# EAGLE design nrf52withamp (EAGLE 8.7.0)
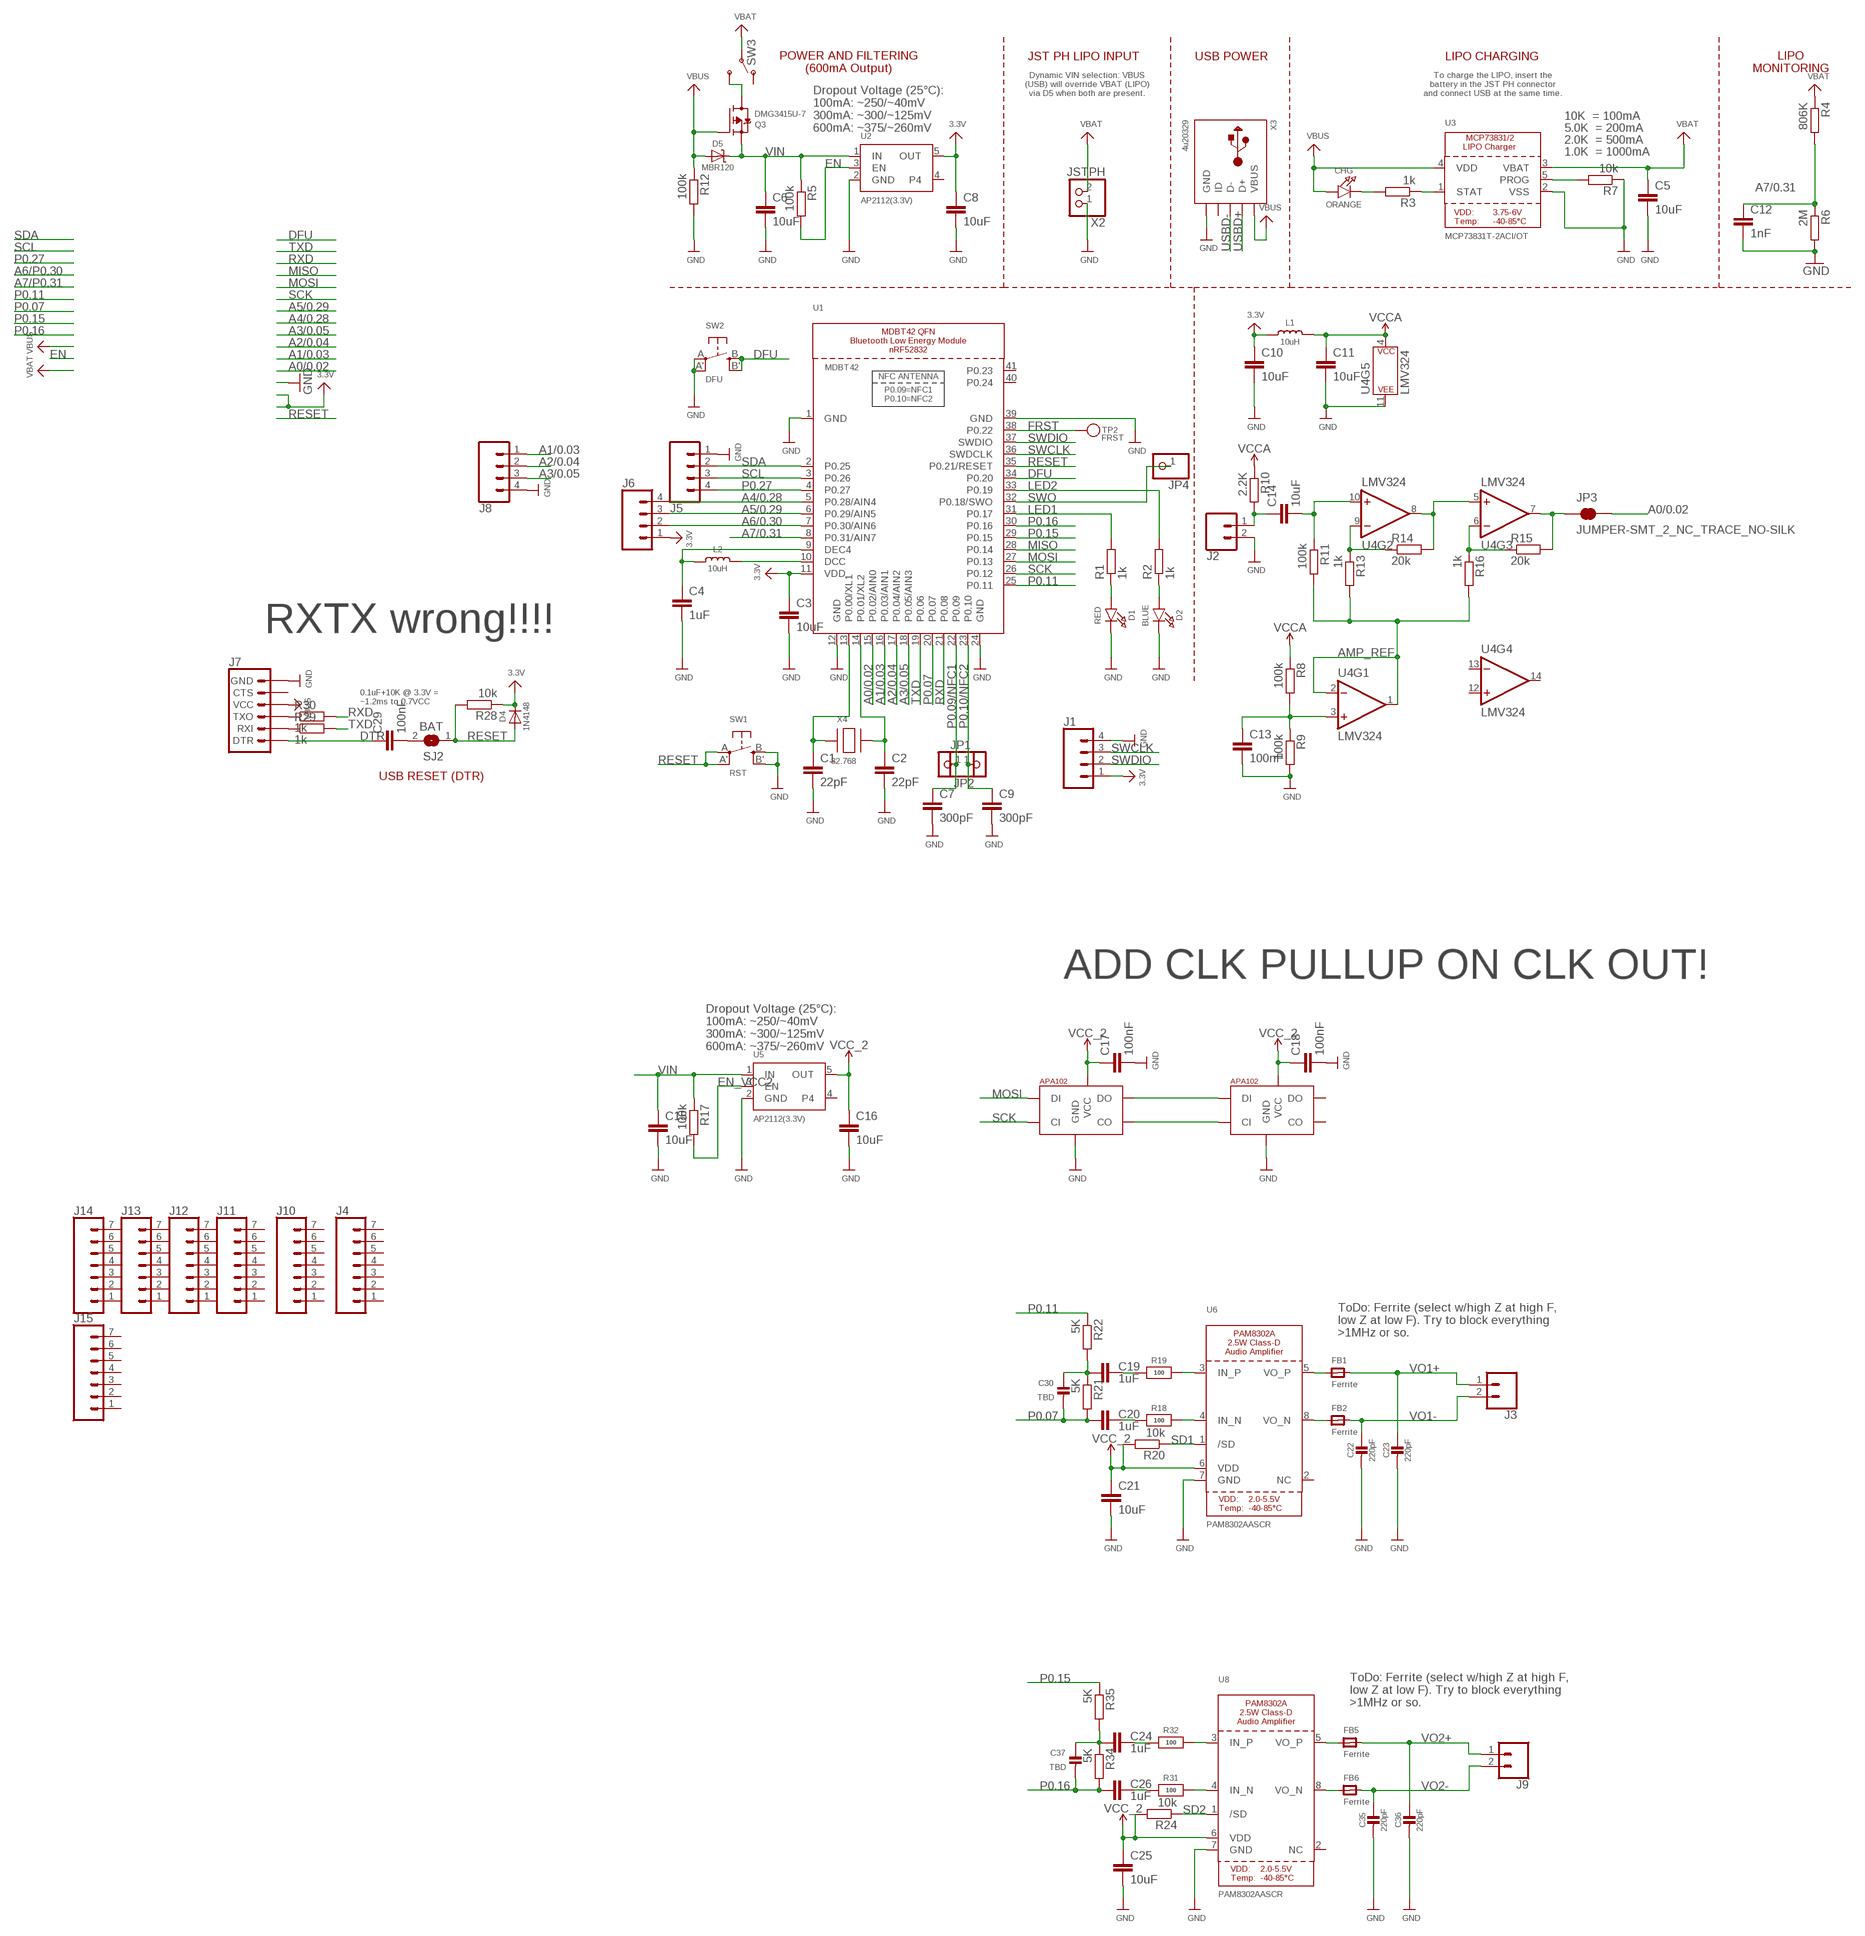
[diagram p0: schematic, sheet 1]

## Parts
C1  22pF  C-EUC0805  [C0805]
C2  22pF  C-EUC0805  [C0805]
C3  10uF  C-EUC0805  [C0805]
C4  1uF  C-EUC0805  [C0805]
C5  10uF  C-EUC0805  [C0805]
C6  10uF  C-EUC0805  [C0805]
C7  300pF  C-EUC0805  [C0805]
C8  10uF  C-EUC0805  [C0805]
C9  300pF  C-EUC0805  [C0805]
C10  10uF  C-EUC0805  [C0805]
C11  10uF  C-EUC0805  [C0805]
C12  1nF  C-EUC0805  [C0805]
C13  100nF  C-EUC0805  [C0805]
C14  10uF  C-EUC0805  [C0805]
C15  10uF  C-EUC0805  [C0805]
C16  10uF  C-EUC0805  [C0805]
C17  100nF  C-EUC0805  [C0805]
C18  100nF  C-EUC0805  [C0805]
C19  1uF  C-EUC0805  [C0805]
C20  1uF  C-EUC0805  [C0805]
C21  10uF  C-EUC0805  [C0805]
C22  220pF  CAP_CERAMIC0805-NOOUTLINE  [0805-NO]
C23  220pF  CAP_CERAMIC0805-NOOUTLINE  [0805-NO]
C24  1uF  C-EUC0805  [C0805]
C25  10uF  C-EUC0805  [C0805]
C26  1uF  C-EUC0805  [C0805]
C29  100nF  C-EUC0805  [C0805]
C30  TBD  CAP_CERAMIC0805-NOOUTLINE  [0805-NO]
C35  220pF  CAP_CERAMIC0805-NOOUTLINE  [0805-NO]
C36  220pF  CAP_CERAMIC0805-NOOUTLINE  [0805-NO]
C37  TBD  CAP_CERAMIC0805-NOOUTLINE  [0805-NO]
CHG  ORANGE  LED0805_NOOUTLINE  [CHIPLED_0805_NOOUTLINE]
D1  RED  LED0805_NOOUTLINE  [CHIPLED_0805_NOOUTLINE]
D2  BLUE  LED0805_NOOUTLINE  [CHIPLED_0805_NOOUTLINE]
D4  1N4148  DIODESOD-323  [SOD-323]
D5  MBR120  DIODE-SCHOTTKYSOD-123  [SOD-123]
FB1  Ferrite  FERRITE_0805  [_0805]
FB2  Ferrite  FERRITE_0805  [_0805]
FB5  Ferrite  FERRITE_0805  [_0805]
FB6  Ferrite  FERRITE_0805  [_0805]
J1  CONN_04SMD  [1X04_SMD_RA_MALE]
J2  CONN_02  [1X02]
J3  CONN_02  [1X02]
J4  CONN_07  [1X07]
J5  CONN_041.27MM  [1X04_1.27MM]
J6  CONN_041.27MM  [1X04_1.27MM]
J7  6_PIN_SERIAL_TARGETRA_SMT  [6_PIN_SERIAL_TARGET_SIDE_RA_SMT]
J8  CONN_041.27MM  [1X04_1.27MM]
J9  CONN_02  [1X02]
J10  CONN_07  [1X07]
J11  CONN_07  [1X07]
J12  CONN_07  [1X07]
J13  CONN_07  [1X07]
J14  CONN_07  [1X07]
J15  CONN_07  [1X07]
JP1  HEADER-1X12MM  [1X01_2MM]
JP2  HEADER-1X12MM  [1X01_2MM]
JP3  JUMPER-SMT_2_NC_TRACE_NO-SILK  [SMT-JUMPER_2_NC_TRACE_NO-SILK]
JP4  HEADER-1X12MM  [1X01_2MM]
L1  10uH  INDUCTOR0805-NO  [0805-NO@1]
L2  10uH  INDUCTOR0805-NO  [0805-NO@1]
Q3  DMG3415U-7  MOSFET-P  [SOT23-R]
R1  1k  R-EU_R0805  [R0805]
R2  1k  R-EU_R0805  [R0805]
R3  1k  R-EU_R0805  [R0805]
R4  806K  R-EU_R0805  [R0805]
R5  100k  R-EU_R0805  [R0805]
R6  2M  R-EU_R0805  [R0805]
R7  10k  R-EU_R0805  [R0805]
R8  100k  R-EU_R0805  [R0805]
R9  100k  R-EU_R0805  [R0805]
R10  2.2K  R-EU_R0805  [R0805]
R11  100k  R-EU_R0805  [R0805]
R12  100k  R-EU_R0805  [R0805]
R13  1k  R-EU_R0805  [R0805]
R14  20k  R-EU_R0805  [R0805]
R15  20k  R-EU_R0805  [R0805]
R16  1k  R-EU_R0805  [R0805]
R17  100k  R-EU_R0805  [R0805]
R18  100  RESISTOR0805_NOOUTLINE  [0805-NO]
R19  100  RESISTOR0805_NOOUTLINE  [0805-NO]
R20  10k  R-EU_R0805  [R0805]
R21  5K  R-EU_R0805  [R0805]
R22  5K  R-EU_R0805  [R0805]
R24  10k  R-EU_R0805  [R0805]
R28  10k  R-EU_R0805  [R0805]
R29  1k  R-EU_R0805  [R0805]
R30  1k  R-EU_R0805  [R0805]
R31  100  RESISTOR0805_NOOUTLINE  [0805-NO]
R32  100  RESISTOR0805_NOOUTLINE  [0805-NO]
R34  5K  R-EU_R0805  [R0805]
R35  5K  R-EU_R0805  [R0805]
SJ2  BAT  SOLDERJUMPERCLOSED  [SOLDERJUMPER_CLOSEDWIRE]
SW1  RST  SWITCH_TACT_SMT4.6X2.8  [BTN_KMR2_4.6X2.8]
SW2  DFU  SWITCH_TACT_SMT4.6X2.8  [BTN_KMR2_4.6X2.8]
SW3  SWITCH_SPDT  [KPS-1290]
TP2  FRST  TESTPOINT1.5X2.0MM_NOCREAM  [PAD-1.5X2.0]
U1  MDBT42  NRF52832_MODULE_MDBT42  [BLE_MODULE_RAYTAC_MDBT42]
U2  AP2112(3.3V)  VREG_SOT23-5  [SOT23-5]
U3  MCP73831T-2ACI/OT  MCP73831/2  [SOT23-5]
U4  LMV324  [SO14]
U5  AP2112(3.3V)  VREG_SOT23-5  [SOT23-5]
U6  PAM8302AASCR  AUDIOAMP_PAM8302A  [MSOP8_0.65MM]
U8  PAM8302AASCR  AUDIOAMP_PAM8302A  [MSOP8_0.65MM]
U$45  APA1022020  [APA102_2020]
U$51  APA1022020  [APA102_2020]
X2  JSTPH  CON_JST_PH_2PIN  [JSTPH2]
X3  4u20329  USB_MICRO_20329_V2  [4UCONN_20329_V2]
X4  32.768  XTAL-3.2X1.5  [XTAL3215]

## Nets
3.3V: C3.1 C8.1 C10.1 D4.C J1.1 J6.1 L1.1 R28.1 U1.11(VDD) U2.5(OUT)
A0/0.02: JP3.2 U1.15(P0.02/AIN0)
A1/0.03: J8.1 U1.16(P0.03/AIN1)
A2/0.04: J8.2 U1.17(P0.04/AIN2)
A3/0.05: J8.3 U1.18(P0.05/AIN3)
A4/0.28: J6.4 U1.5(P0.28/AIN4)
A5/0.29: J6.3 U1.6(P0.29/AIN5)
A6/0.30: J6.2 U1.7(P0.30/AIN6)
A7/0.31: C12.1 R4.2 R6.1 U1.8(P0.31/AIN7)
AMP_REF: R11.2 R13.2 R16.2 U4.1(OUT) U4.2(-IN)
CO1: U$45.CL_OUT(CO) U$51.C_IN(CI)
DFU: SW2.B'(S1) SW2.B(S) U1.34(P0.20)
DTR: C29.1 J7.1(DTR)
EN: R5.2 U2.3(EN)
EN_VCC2: R17.2 U5.3(EN)
FRST: TP2.P$1 U1.38(P0.22)
GND: C1.2 C2.2 C3.2 C4.2 C5.2 C6.2 C7.2 C8.2 C9.2 C10.2 C11.2 C12.2 C13.2 C15.2 C16.2 C17.2 C18.2 C21.2 C22.2 C23.2 C25.2 C35.2 C36.2 D1.C D2.C J1.4 J2.2 J5.1 J7.6(GND) J8.4 R6.2 R7.1 R9.2 R12.2 SW1.B'(S1) SW1.B(S) SW2.A'(P1) SW2.A(P) U1.1(GND) U1.12(GND) U1.24(GND) U1.39(GND) U2.2(GND) U3.2(VSS) U4.11(P$V-) U5.2(GND) U6.7(GND) U8.7(GND) U$45.GND U$51.GND X2.1 X3.BASE@1(GND) X3.BASE@2(GND) X3.GND X3.SPRT@1(GND) X3.SPRT@2(GND) X3.SPRT@3(GND) X3.SPRT@4(GND)
LED1: R1.2 U1.31(P0.17)
LED2: R2.2 U1.33(P0.19)
MISO: U1.28(P0.14)
MOSI: U1.27(P0.13) U$45.D_IN(DI)
N$1: C1.1 U1.13(P0.00/XL1) X4.P$1
N$2: C2.1 U1.14(P0.01/XL2) X4.P$2
N$3: L2.2 U1.10(DCC)
N$4: CHG.C R3.2
N$5: D1.A R1.1
N$6: C13.1 R8.2 R9.1 U4.3(+IN)
N$7: D2.A R2.1
N$8: C4.1 L2.1 U1.9(DEC4)
N$9: R3.1 U3.1(STAT)
N$10: R7.2 U3.5(PROG)
N$11: C14.1 J2.1 R10.2
N$12: C14.2 R11.1 U4.10(+IN)
N$13: C29.2 SJ2.2
N$14: U$45.D_OUT(DO) U$51.D_IN(DI)
N$15: R13.1 R14.1 U4.9(-IN)
N$16: R14.2 U4.5(+IN) U4.8(OUT)
N$17: R15.1 R16.1 U4.6(-IN)
N$18: JP3.1 R15.2 U4.7(OUT)
N$19: R18.2 U6.4(IN_N)
N$20: R19.2 U6.3(IN_P)
N$21: C20.2 R18.1
N$22: FB2.1 U6.8(VO_N)
N$23: FB1.1 U6.5(VO_P)
N$24: C19.2 R19.1
N$25: C19.1 C30.1 R21.1 R22.2
N$26: Q3.3(D) SW3.S
N$33: J7.3(RXI) R29.1
N$34: J7.2(TXO) R30.1
N$35: R31.2 U8.4(IN_N)
N$36: R32.2 U8.3(IN_P)
N$37: C26.2 R31.1
N$38: FB6.1 U8.8(VO_N)
N$39: FB5.1 U8.5(VO_P)
N$40: C24.2 R32.1
N$41: C24.1 C37.1 R34.1 R35.2
P0.07: C20.1 C30.2 R21.2 U1.20(P0.07)
P0.09/NFC1: C7.1 JP2.1 U1.22(P0.09)
P0.10/NFC2: C9.1 JP1.1 U1.23(P0.10)
P0.11: R22.1 U1.25(P0.11)
P0.15: R35.1 U1.29(P0.15)
P0.16: C26.1 C37.2 R34.2 U1.30(P0.16)
P0.27: J5.4 U1.4(P0.27)
RESET: D4.A R28.2 SJ2.1 SW1.A'(P1) SW1.A(P) U1.35(P0.21/RESET)
RXD: R30.2 U1.21(P0.08)
SCK: U1.26(P0.12) U$45.C_IN(CI)
SCL: J5.3 U1.3(P0.26)
SD1: R20.1 U6.1(/SD)
SD2: R24.1 U8.1(/SD)
SDA: J5.2 U1.2(P0.25)
SWCLK: J1.3 U1.36(SWDCLK)
SWDIO: J1.2 U1.37(SWDIO)
SWO: JP4.1 U1.32(P0.18/SWO)
TXD: R29.2 U1.19(P0.06)
USBD+: X3.D+
USBD-: X3.D-
VBAT: C5.1 R4.1 SW3.P U3.3(VBAT) X2.2
VBUS: CHG.A D5.A J7.4(VCC) Q3.1(G) R12.1 U3.4(VDD) X3.VBUS
VCC_2: C16.1 C17.1 C18.1 C21.1 C25.1 R20.2 R24.2 U5.5(OUT) U6.6(VDD) U8.6(VDD) U$45.V_CC(VCC) U$51.V_CC(VCC)
VCCA: C11.1 L1.2 R8.1 R10.1 U4.4(P$V+)
VIN: C6.1 C15.1 D5.C Q3.2(S) R5.1 R17.1 U2.1(IN) U5.1(IN)
VO1+: C23.1 FB1.2 J3.1
VO1-: C22.1 FB2.2 J3.2
VO2+: C36.1 FB5.2 J9.1
VO2-: C35.1 FB6.2 J9.2
Unconnected: J4.1 J4.2 J4.3 J4.4 J4.5 J4.6 J4.7 J7.5(CTS) J10.1 J10.2 J10.3 J10.4 J10.5 J10.6 J10.7 J11.1 J11.2 J11.3 J11.4 J11.5 J11.6 J11.7 J12.1 J12.2 J12.3 J12.4 J12.5 J12.6 J12.7 J13.1 J13.2 J13.3 J13.4 J13.5 J13.6 J13.7 J14.1 J14.2 J14.3 J14.4 J14.5 J14.6 J14.7 J15.1 J15.2 J15.3 J15.4 J15.5 J15.6 J15.7 SW3.O U1.40(P0.24) U1.41(P0.23) U2.4 U4.12(+IN) U4.13(-IN) U4.14(OUT) U5.4 U6.2(NC) U8.2(NC) U$51.CL_OUT(CO) U$51.D_OUT(DO) X3.ID

## Notes on the sheet
- JST PH LIPO INPUT | USB POWER | LIPO CHARGING
- POWER AND FILTERING
  (600mA Output)
- LIPO
  MONITORING
- Dynamic VIN selection: VBUS
  (USB) will override VBAT (LIPO)
  via D5 when both are present.
- To charge the LIPO, insert the
  battery in the JST PH connector
  and connect USB at the same time.
- 10K  = 100mA
- Dropout Voltage (25°C):
  100mA: ~250/~40mV
  300mA: ~300/~125mV
  600mA: ~375/~260mV
- 5.0K  = 200mA
- 2.0K  = 500mA
- 1.0K  = 1000mA
- RXTX wrong!!!!
- 0.1uF+10K @ 3.3V =
  ~1.2ms to 0.7VCC
- USB RESET (DTR)
- ADD CLK PULLUP ON CLK OUT!
- Dropout Voltage (25°C):
  100mA: ~250/~40mV
  300mA: ~300/~125mV
  600mA: ~375/~260mV
- ToDo: Ferrite (select w/high Z at high F,
  low Z at low F). Try to block everything
  >1MHz or so.
- ToDo: Ferrite (select w/high Z at high F,
  low Z at low F). Try to block everything
  >1MHz or so.

## Library data of the parts
C1 C2 = rcl:C-EU: CAPACITOR, European symbol; LCSC: C1836; SPICEPREFIX: C
C3 C5 C6 C8 C10 C11 C14-C16 C21 C25 = rcl:C-EU: CAPACITOR, European symbol; LCSC: C1713; SPICEPREFIX: C
C4 C19 C20 C24 C26 = rcl:C-EU: CAPACITOR, European symbol; LCSC: C29822; SPICEPREFIX: C
C7 C9 = rcl:C-EU: CAPACITOR, European symbol; LCSC: C1735; SPICEPREFIX: C
C12 = rcl:C-EU: CAPACITOR, European symbol; LCSC: C16005; SPICEPREFIX: C
C13 C17 C18 C29 = rcl:C-EU: CAPACITOR, European symbol; LCSC: C28378; SPICEPREFIX: C
C22 C23 C35 C36 = microbuilder:CAP_CERAMIC: Ceramic Capacitors For new designs, use the packages preceded by an '_' character since they are more reliable: The following footprints should be used on most boards: _0402 - Standard footprint for regular board layouts _0603 - Standard footprint for regular board layouts _0805 - Standard footprint for regular board layouts _1206 - Standard footprint for regular board layouts For extremely tight-pitch boards where space is at a premium, the following 'micro-pitch' footprints can be used (smaller pads, no silkscreen outline, etc.): _0402MP - Micro-pitch footprint for very dense/compact boards _0603MP - Micro-pitch footprint for very dense/compact boards _0805MP - Micro-pitch footprint for very dense/compact boards _1206MP - Micro-pitch footprint for very dense/compact boards; LCSC: C46326
C30 C37 = microbuilder:CAP_CERAMIC: Ceramic Capacitors For new designs, use the packages preceded by an '_' character since they are more reliable: The following footprints should be used on most boards: _0402 - Standard footprint for regular board layouts _0603 - Standard footprint for regular board layouts _0805 - Standard footprint for regular board layouts _1206 - Standard footprint for regular board layouts For extremely tight-pitch boards where space is at a premium, the following 'micro-pitch' footprints can be used (smaller pads, no silkscreen outline, etc.): _0402MP - Micro-pitch footprint for very dense/compact boards _0603MP - Micro-pitch footprint for very dense/compact boards _0805MP - Micro-pitch footprint for very dense/compact boards _1206MP - Micro-pitch footprint for very dense/compact boards
CHG = microbuilder:LED: LED 0603 - 0603 Surface Mount Package 2mA: Green LED - Low Power (3.9mcd, 2ma, 1.7Vf) - Digikey: 475-2709-2-ND Orange LED - Low Power (9.8mcd, 2ma, 1.8Vf) - Digikey: 475-1194-2-ND Red LED - Low Power (5mcd, 2ma, 1.8Vf) - Digikey: 475-1195-2-ND Yellow LED - Low Power (7mcd, 2ma, 1.8Vf) - Digikey: 475-1196-2-ND 5mA: Blue LED - Low Power (17mcd, 5ma, 2.9Vf) - Digikey: LNJ937W8CRACT-ND 0805 - 0805 Surface Mount Package 2mA: Red LED (8.8mcd, 2mA, 1.8Vf, Clear) - Low Power [Digikey: 475-2510-1-ND] Green LED (5mcd, 2mA, 1.8Vf, Clear) - Low Power [Digikey: 475-2730-1-ND] Yellow LED (11.3mcd, 2mA, 1.8Vf, Clear) - Low Power [Digikey: 475-2555-1-ND] 20mA: Red LED (104mcd, 20mA, Diffused) - LS R976 [Digikey: 475-1278-6-ND] Red LED (12mcd, 20mA, 2.0Vf, Clear) - APT2012EC [Digikey: 754-1128-1-ND] Green LED (15mcd, 20mA, 2.2Vf, Clear) - APT2012GC [Digikey: 754-1131-1-ND] Orange LED (160mcd, 20mA, 2.1Vf, Clear) - APT2012SECK [Digikey: 754-1130-1-ND] 1206 - 1206 Surface Mount Package Green LED (26mcd, 20mA, Diffused) - LG N971 [Digikey: 475-1407-6-ND] Red LED (15mcd, 20mA, Diffused) - LH N974 [Digikey: 475-1416-6-ND] Cree - Cree High-Power Surface Mount LEDs XPEBWT-L1-0000-00D50 - White 111lm 350mA 2.9Vf 6200K 110° XTEAWT-00-0000-00000LEE3 - White 114lm 350mA 2.85Vf 5000K 115° Everlight - Everlight 45-21 Series Surface Mount LEDs 45-21/QK2C-B2832AC2CB2/2T - Warm White 2000mcd 20mA 3.25Vf 3050K 120° 45-21/LK2C-B38452C4CB2/2T - Nuetral White 2000mcd 20mA 3.25Vf 4150K 120° 45-21/LK2C-B50634C6CB2/2T - Cold White 2200mcd 20mA 3.25Vf 5650K 120° PLCC2 Reverse Mount LS T77K-J1L2-1-0-2-R18-Z - Red 11.25mcd 2mA 1.8Vf 630nm 120° LO T77K-L1M2-24-Z - Orange 19.6mcd 2mA 1.8Vf 606nm 120° LY T77K-K2M1-26-Z - Yellow 15.7mcd 2mA 1.8Vf 587nm 120°; LCSC: C154481
D1 = microbuilder:LED: LED 0603 - 0603 Surface Mount Package 2mA: Green LED - Low Power (3.9mcd, 2ma, 1.7Vf) - Digikey: 475-2709-2-ND Orange LED - Low Power (9.8mcd, 2ma, 1.8Vf) - Digikey: 475-1194-2-ND Red LED - Low Power (5mcd, 2ma, 1.8Vf) - Digikey: 475-1195-2-ND Yellow LED - Low Power (7mcd, 2ma, 1.8Vf) - Digikey: 475-1196-2-ND 5mA: Blue LED - Low Power (17mcd, 5ma, 2.9Vf) - Digikey: LNJ937W8CRACT-ND 0805 - 0805 Surface Mount Package 2mA: Red LED (8.8mcd, 2mA, 1.8Vf, Clear) - Low Power [Digikey: 475-2510-1-ND] Green LED (5mcd, 2mA, 1.8Vf, Clear) - Low Power [Digikey: 475-2730-1-ND] Yellow LED (11.3mcd, 2mA, 1.8Vf, Clear) - Low Power [Digikey: 475-2555-1-ND] 20mA: Red LED (104mcd, 20mA, Diffused) - LS R976 [Digikey: 475-1278-6-ND] Red LED (12mcd, 20mA, 2.0Vf, Clear) - APT2012EC [Digikey: 754-1128-1-ND] Green LED (15mcd, 20mA, 2.2Vf, Clear) - APT2012GC [Digikey: 754-1131-1-ND] Orange LED (160mcd, 20mA, 2.1Vf, Clear) - APT2012SECK [Digikey: 754-1130-1-ND] 1206 - 1206 Surface Mount Package Green LED (26mcd, 20mA, Diffused) - LG N971 [Digikey: 475-1407-6-ND] Red LED (15mcd, 20mA, Diffused) - LH N974 [Digikey: 475-1416-6-ND] Cree - Cree High-Power Surface Mount LEDs XPEBWT-L1-0000-00D50 - White 111lm 350mA 2.9Vf 6200K 110° XTEAWT-00-0000-00000LEE3 - White 114lm 350mA 2.85Vf 5000K 115° Everlight - Everlight 45-21 Series Surface Mount LEDs 45-21/QK2C-B2832AC2CB2/2T - Warm White 2000mcd 20mA 3.25Vf 3050K 120° 45-21/LK2C-B38452C4CB2/2T - Nuetral White 2000mcd 20mA 3.25Vf 4150K 120° 45-21/LK2C-B50634C6CB2/2T - Cold White 2200mcd 20mA 3.25Vf 5650K 120° PLCC2 Reverse Mount LS T77K-J1L2-1-0-2-R18-Z - Red 11.25mcd 2mA 1.8Vf 630nm 120° LO T77K-L1M2-24-Z - Orange 19.6mcd 2mA 1.8Vf 606nm 120° LY T77K-K2M1-26-Z - Yellow 15.7mcd 2mA 1.8Vf 587nm 120°; LCSC: C72037
D2 = microbuilder:LED: LED 0603 - 0603 Surface Mount Package 2mA: Green LED - Low Power (3.9mcd, 2ma, 1.7Vf) - Digikey: 475-2709-2-ND Orange LED - Low Power (9.8mcd, 2ma, 1.8Vf) - Digikey: 475-1194-2-ND Red LED - Low Power (5mcd, 2ma, 1.8Vf) - Digikey: 475-1195-2-ND Yellow LED - Low Power (7mcd, 2ma, 1.8Vf) - Digikey: 475-1196-2-ND 5mA: Blue LED - Low Power (17mcd, 5ma, 2.9Vf) - Digikey: LNJ937W8CRACT-ND 0805 - 0805 Surface Mount Package 2mA: Red LED (8.8mcd, 2mA, 1.8Vf, Clear) - Low Power [Digikey: 475-2510-1-ND] Green LED (5mcd, 2mA, 1.8Vf, Clear) - Low Power [Digikey: 475-2730-1-ND] Yellow LED (11.3mcd, 2mA, 1.8Vf, Clear) - Low Power [Digikey: 475-2555-1-ND] 20mA: Red LED (104mcd, 20mA, Diffused) - LS R976 [Digikey: 475-1278-6-ND] Red LED (12mcd, 20mA, 2.0Vf, Clear) - APT2012EC [Digikey: 754-1128-1-ND] Green LED (15mcd, 20mA, 2.2Vf, Clear) - APT2012GC [Digikey: 754-1131-1-ND] Orange LED (160mcd, 20mA, 2.1Vf, Clear) - APT2012SECK [Digikey: 754-1130-1-ND] 1206 - 1206 Surface Mount Package Green LED (26mcd, 20mA, Diffused) - LG N971 [Digikey: 475-1407-6-ND] Red LED (15mcd, 20mA, Diffused) - LH N974 [Digikey: 475-1416-6-ND] Cree - Cree High-Power Surface Mount LEDs XPEBWT-L1-0000-00D50 - White 111lm 350mA 2.9Vf 6200K 110° XTEAWT-00-0000-00000LEE3 - White 114lm 350mA 2.85Vf 5000K 115° Everlight - Everlight 45-21 Series Surface Mount LEDs 45-21/QK2C-B2832AC2CB2/2T - Warm White 2000mcd 20mA 3.25Vf 3050K 120° 45-21/LK2C-B38452C4CB2/2T - Nuetral White 2000mcd 20mA 3.25Vf 4150K 120° 45-21/LK2C-B50634C6CB2/2T - Cold White 2200mcd 20mA 3.25Vf 5650K 120° PLCC2 Reverse Mount LS T77K-J1L2-1-0-2-R18-Z - Red 11.25mcd 2mA 1.8Vf 630nm 120° LO T77K-L1M2-24-Z - Orange 19.6mcd 2mA 1.8Vf 606nm 120° LY T77K-K2M1-26-Z - Yellow 15.7mcd 2mA 1.8Vf 587nm 120°; LCSC: C2293
D4 = microbuilder:DIODE: Diode SMA Model Volts Amps Type Vf Ir Digikey # Notes SSA34-E3 40V 3A Schottky 480mV @ 3A 200uA @ 40V SSA34-E3/61TGITR-ND CDBA120-G 20V 1A Schottky 500mV @ 1A 500uA @ 20V 641-1014-6-ND REEL MBRA210 10V 2A Schottky 350mV @ 2A 700uA @ 10V MBRA210LT3 SOD-123 Model Volts Amps Type Vf Ir Order # Notes BAT54T1G 30V 200mA Schottky 800mV @ 200mA 2uA @ 25V BAT54T1GOSTR-ND B0530W 30V 500mA Schottky 430mV @ 500mA 130uA @ 30V B0530W-FDICT-ND REEL MBR120 20V 1A Schottky 340mV @ 1A MBR120VLSFT1GOSCT-ND SOD-323 Model Volts Amps Type Vf Ir Order # Notes PMEG2005EJ 20V 500mA Schottky 355mV @ 500mA 568-4110-1-ND ZLLS410 10V 570mA Schottky 380mV @ 570mA ZLLS410CT-ND 1N4148WS 75V 150mA Silicon/Simple 1V 1N4148WSFSCT-ND REEL SOD-523 Model Volts Amps Type Vf Ir Order # Notes BAT54XV2 30V 200mA Schottky 0.8V @ 100mA BAT54XV2CT-ND TB751S 30V 30mA Schottky RB751S-40TE61CT-ND SOT23-R/W (R = Solder Paste/Reflow Ovens, W = Hand-Soldering) Model Volts Amps Type Vf Ir Order # Notes BAT54FILM 40V 300mA Schottky 497-7162-1-ND POWERDI-5 Model Volts Amps Type Vf Ir Order # Notes PDS560 60V 5A Schottky 670mV @ 5A 150uA @ 60V PDS560DICT-ND; LCSC: C99332
D5 = microbuilder:DIODE-SCHOTTKY; LCSC: C130880
FB1 FB2 FB5 FB6 = microbuilder:FERRITE: Ferrite Bead 0603 MMZ1608B121C - 120 Ohm @ 100MHz, 600mA, 0.15 Ohm DC Resistance - Digikey: 445-2164-1-ND BK1608HW121-T - 120 Ohm, 600mA Ferrite Chip - Digikey: 587-1876-2-ND 0805 HZ0805B272R-10 - 2.7K Ohm @ 100MHz, 200mA, 0.8 Ohm DC Resistance - Digikey: 240-2504-1-ND (see also Murata BLM21BD272SN1L) MMZ2012Y152B - 1.5K Ohm @ 100MHz, 500mA, 0.4 Ohm DC Resistance - Digikey: 445-1560-1-ND - Mainly for high frequency (80-400MHz) MMZ2012R102A - 1K Ohm @ 100MHz, 500mA, 0.3 Ohm DC Resistance - Digikey: 445-1555-2-ND - More general purpose (10-200MHz); LCSC: C12389
J1 = SparkFun-Connectors:CONN_04: Multi connection point. Often used as Generic Header-pin footprint for 0.1 inch spaced/style header connections On any of the 0.1 inch spaced packages, you can populate with these: Break Away Headers - Straight <https://www.sparkfun.com/products/116> (PRT-00116) Break Away Male Headers - Right Angle <https://www.sparkfun.com/products/553> (PRT-00553) Female Headers <https://www.sparkfun.com/products/115> (PRT-00115) Break Away Headers - Machine Pin <https://www.sparkfun.com/products/117> (PRT-00117) Break Away Female Headers - Swiss Machine Pin <https://www.sparkfun.com/products/743> (PRT-00743) For SCREWTERMINALS and SPRING TERMINALS visit here: Screw Terimnals on SparkFun.com <https://www.sparkfun.com/search/results?term=Screw+Terminals> (5mm/3.5mm/2.54mm spacing) This device is also useful as a general connection point to wire up your design to another part of your project. Our various solder wires solder well into these plated through hole pads. Hook-Up Wire - Assortment (Stranded, 22 AWG) <https://www.sparkfun.com/products/11375> (PRT-11375) Hook-Up Wire - Assortment (Solid Core, 22 AWG) <https://www.sparkfun.com/products/11367> (PRT-11367) View the entire wire category on our website here <https://www.sparkfun.com/categories/141> Special notes: Molex polarized connector foot print use with SKU : PRT-08231 with associated crimp pins and housings. 1MM SMD Version SKU: PRT-10208; PROD_ID: CONN-09140; SF_ID: PRT-12638
J2 J3 J9 = SparkFun-Connectors:CONN_02: Multi connection point. Often used as Generic Header-pin footprint for 0.1 inch spaced/style header connections On any of the 0.1 inch spaced packages, you can populate with these: Break Away Headers - Straight <https://www.sparkfun.com/products/116> (PRT-00116) Break Away Male Headers - Right Angle <https://www.sparkfun.com/products/553> (PRT-00553) Female Headers <https://www.sparkfun.com/products/115> (PRT-00115) Break Away Headers - Machine Pin <https://www.sparkfun.com/products/117> (PRT-00117) Break Away Female Headers - Swiss Machine Pin <https://www.sparkfun.com/products/743> (PRT-00743) For SCREWTERMINALS and SPRING TERMINALS visit here: Screw Terimnals on SparkFun.com <https://www.sparkfun.com/search/results?term=Screw+Terminals> (5mm/3.5mm/2.54mm spacing) This device is also useful as a general connection point to wire up your design to another part of your project. Our various solder wires solder well into these plated through hole pads. Hook-Up Wire - Assortment (Stranded, 22 AWG) <https://www.sparkfun.com/products/11375> (PRT-11375) Hook-Up Wire - Assortment (Solid Core, 22 AWG) <https://www.sparkfun.com/products/11367> (PRT-11367) View the entire wire category on our website here <https://www.sparkfun.com/categories/141> Special notes: Molex polarized connector foot print use with: PRT-08233 with associated crimp pins and housings. 2.54_SCREWTERM for use with PRT-10571. 3.5mm Screw Terminal footprints for PRT-08084 5mm Screw Terminal footprints for use with PRT-08432
J4 J10-J15 = SparkFun-Connectors:CONN_07: Multi connection point. Often used as Generic Header-pin footprint for 0.1 inch spaced/style header connections On any of the 0.1 inch spaced packages, you can populate with these: Break Away Headers - Straight <https://www.sparkfun.com/products/116> (PRT-00116) Break Away Male Headers - Right Angle <https://www.sparkfun.com/products/553> (PRT-00553) Female Headers <https://www.sparkfun.com/products/115> (PRT-00115) Break Away Headers - Machine Pin <https://www.sparkfun.com/products/117> (PRT-00117) Break Away Female Headers - Swiss Machine Pin <https://www.sparkfun.com/products/743> (PRT-00743) For SCREWTERMINALS and SPRING TERMINALS visit here: Screw Terimnals on SparkFun.com <https://www.sparkfun.com/search/results?term=Screw+Terminals> (5mm/3.5mm/2.54mm spacing) This device is also useful as a general connection point to wire up your design to another part of your project. Our various solder wires solder well into these plated through hole pads. Hook-Up Wire - Assortment (Stranded, 22 AWG) <https://www.sparkfun.com/products/11375> (PRT-11375) Hook-Up Wire - Assortment (Solid Core, 22 AWG) <https://www.sparkfun.com/products/11367> (PRT-11367) View the entire wire category on our website here <https://www.sparkfun.com/categories/141> Special notes: Molex polarized connector foot print use with SKU : PRT-08231 with associated crimp pins and housings. 1MM SMD Version SKU: PRT-10208 NOTES ON THE VARIANTS LOCK and LOCK_LONGPADS... This footprint was designed to help hold the alignment of a through-hole component (i.e. 6-pin header) while soldering it into place. You may notice that each hole has been shifted either up or down by 0.005 of an inch from it's more standard position (which is a perfectly straight line). This slight alteration caused the pins (the squares in the middle) to touch the edges of the holes. Because they are alternating, it causes a "brace" to hold the component in place. 0.005 has proven to be the perfect amount of "off-center" position when using our standard breakaway headers. Although looks a little odd when you look at the bare footprint, once you have a header in there, the alteration is very hard to notice. Also,if you push a header all the way into place, it is covered up entirely on the bottom side.
J5 J6 J8 = SparkFun-Connectors:CONN_04: Multi connection point. Often used as Generic Header-pin footprint for 0.1 inch spaced/style header connections On any of the 0.1 inch spaced packages, you can populate with these: Break Away Headers - Straight <https://www.sparkfun.com/products/116> (PRT-00116) Break Away Male Headers - Right Angle <https://www.sparkfun.com/products/553> (PRT-00553) Female Headers <https://www.sparkfun.com/products/115> (PRT-00115) Break Away Headers - Machine Pin <https://www.sparkfun.com/products/117> (PRT-00117) Break Away Female Headers - Swiss Machine Pin <https://www.sparkfun.com/products/743> (PRT-00743) For SCREWTERMINALS and SPRING TERMINALS visit here: Screw Terimnals on SparkFun.com <https://www.sparkfun.com/search/results?term=Screw+Terminals> (5mm/3.5mm/2.54mm spacing) This device is also useful as a general connection point to wire up your design to another part of your project. Our various solder wires solder well into these plated through hole pads. Hook-Up Wire - Assortment (Stranded, 22 AWG) <https://www.sparkfun.com/products/11375> (PRT-11375) Hook-Up Wire - Assortment (Solid Core, 22 AWG) <https://www.sparkfun.com/products/11367> (PRT-11367) View the entire wire category on our website here <https://www.sparkfun.com/categories/141> Special notes: Molex polarized connector foot print use with SKU : PRT-08231 with associated crimp pins and housings. 1MM SMD Version SKU: PRT-10208
J7 = SparkFun-Connectors:6_PIN_SERIAL_TARGET: 6-pin header connection for use with the "FTDI BASIC" pinout - TARGET SIDE. Also known as "Arduino Serial Program Header". It is used to mate with our FTDI Basic serial programmers using the Arduino IDE. Note, this device has "TARGET" in the name. It is intended to be used on a design that contains a target micro-controller that you wish to program. The "sister" device, named "CABLE" is inteneded to be used on a design that usually lives on the end of your USB cable and prvides the converter chip (FTDI232 or FTDI231x) to commnicate serial RX/TX. You can populate with some of these: Break Away Headers - Straight <https://www.sparkfun.com/products/116> (PRT-00116) For reference (or to suit your programming needs) check out these designs: SparkFun FTDI Basic Breakout - 5V <https://www.sparkfun.com/products/9716> (DEV-09716) SparkFun FTDI Basic Breakout - 3.3V <https://www.sparkfun.com/products/9873> (DEV-09873) SparkFun FTDI SmartBasic <https://www.sparkfun.com/products/12935> (DEV-12935) SparkFun Beefy 3 - FTDI Basic Breakout <https://www.sparkfun.com/products/13746> (DEV-13746); PROD_ID: CONN-08971
JP1 JP2 JP4 = microbuilder:HEADER-1X1: PIN HEADER
JP3 = SparkFun-Jumpers:JUMPER-SMT_2_NC_TRACE: Normally closed trace jumper This jumper has a trace between two pads so it's normally closed (NC). Use a razor knife to open the connection. For best results follow the IPC guidelines for cutting traces: Cutout at least 0.063 mm (0.005 in). Remove all loose material to clean up the cut area. Seal the cut with an approved epoxy. Reapply solder to reclose the connection.
L1 L2 = microbuilder:INDUCTOR: Inductors 0603: 10nH Ceramic Inductor - microwire antenna/RF (Digikey: 712-1434-2-ND) 0805: 560nH Ceramic Inductor - RF (Digikey: 553-1047-1-ND) 270nH Ceramic Inductor - Q = 40@250MHz, +-5%, 1 Ohm DC Resistance (Digikey: 535-10506-2-ND) 1007 (2518 Metric) SMT: 10µH 10% 250mOhm 820mA 1007 Inductor (Digikey: 587-2189-1-ND) 22µH 10% 500mOhm 580mA 1007 Inductor (Digikey: 587-2190-1-ND) 47µH 10% 950mOhm 420mA 1007 Inductor (Digikey: 587-2191-1-ND) 47µH 5% 100mOhm 1A 1008 Inductor (Digikey: 732-1816-1-ND) 5.0x5.0mm (Taiyo Yuden NR5040 Series) 6.8µH 20% 2.3A 64mOhm Inductor (Digikey: 587-2374-2-ND) 5.0x5.0mm (TDK VLC5045 Series) 4.7µH 20% 3.3A 34mOhm Inductor (Digikey: 445-6526-1-ND) 6.8µH 20% 2.7A 46mOhm Inductor (Digikey: 445-6527-1-ND) 6.0x6.0mm (TDK VLC6045 Series) 4.7µH 20% 3.8A 27mOhm Inductor (Digikey: 445-6538-2-ND) 6.8µH 20% 3A 41mOhm Inductor (Digikey: 445-6540-1-ND) 6.2µH 30% 2.2A 45mOhm Inductor (Digikey: SRR5028-6R2YCT-ND) - Not TDK VLC6045 but footprint should match 6.0x6.0mm (TDK SLF6045 Series) 6.8uH 30% 2A 33mOhm Inductor (Digikey: 445-4572-1-ND, Mouser: 810-SLF645T6R8N2R0PF) 6.0x6.0mm (Sumida CDRH5D28 Series) 6.2uH 30% 1.8A 45mOhm Inductor (Digikey: 308-1542-1-ND) Taiyo Yuden NR3015T2R2M - 2.2uH 20% 1.5A (Digikey: 587-1648-2-ND, Mouser: 963-NR3015T2R2M) - Used with TI TPS62172 CoilCraft RFID Transponder Coil - MA5532-AE (For use with AS3935 Lightning Sensor) Taiyo Yuden NRH2412T2R2MNGH - 2.2uH 20% 1AA (Digikey: 587-3443-1-ND) - Used with TI LM3671 Vishay IHLP 1.0uH Molded Inductor - 24mOhm DCR, 5A, +/-20%, -55°C-125°C (Digikey: 541-1319-1-ND); LCSC: C112611
Q3 = microbuilder:MOSFET-P: P-Channel Mosfet LEGEND VDS: Voltage Drain-Source ID: Drain Current RDS(ON): Drain-Source On-State Resistance VGS(TH): Gate-Source Threshold Voltage CISS: Drain-Source Input Capacitance SOT-23 Name VDS ID RDS(ON) VGS(TH) CISS Order Number IRLML5103 30V 760mA 600 mOhm -- 75pF @ 25V Digikey: IRLML5103PBFCT-ND IRLML6401 12V 4.3A 50 mOhm 950mV @ 250µA 830pF @ 10V Digikey: IRLML6401PBFTR-ND NTR0202PL 20V 400mA 800 mOhm 2.3V @ 250uA 70pF @ 5V Digikey: NTR0202PLT1GOSTR-ND NTR4101PT1G 20V 1.8A 85 mOhm 1.2V @ 250uA 675pF @ 10V Digikey: NTR4101PT1GOSCT-ND DMP2004K 20V 600mA 900 mOhm 1V @ 250uA 175pF @ 16V Digikey: DMP2004KDICT-ND PMV65XP 20V 3.9A 76 mOhm 950mV @ 1mA 725pF @ 20V Digikey: 568-2358-2-ND TO-252 Name VDS ID RDS(ON) VGS(TH) CISS Order Number AOD417 30V 25A 34 mOhm 3V @ 250µA 920pF @ 15V Digikey: 785-1106-2-ND; LCSC: C10487
R1-R3 R13 R16 R29 R30 = rcl:R-EU_: RESISTOR, European symbol; LCSC: C101404; SPICEPREFIX: R
R4 = rcl:R-EU_: RESISTOR, European symbol; LCSC: C104516; SPICEPREFIX: R
R5 R8 R9 R11 R12 R17 = rcl:R-EU_: RESISTOR, European symbol; LCSC: C103905; SPICEPREFIX: R
R6 = rcl:R-EU_: RESISTOR, European symbol; LCSC: C26112; SPICEPREFIX: R
R7 R20 R24 R28 = rcl:R-EU_: RESISTOR, European symbol; LCSC: C84376; SPICEPREFIX: R
R10 = rcl:R-EU_: RESISTOR, European symbol; LCSC: C101970; SPICEPREFIX: R
R14 R15 = rcl:R-EU_: RESISTOR, European symbol; LCSC: C101548; SPICEPREFIX: R
R18 R19 R31 R32 = microbuilder:RESISTOR: Resistors For new designs, use the packages preceded by an '_' character since they are more reliable: The following footprints should be used on most boards: _0402 - Standard footprint for regular board layouts _0603 - Standard footprint for regular board layouts _0805 - Standard footprint for regular board layouts _1206 - Standard footprint for regular board layouts For extremely tight-pitch boards where space is at a premium, the following 'micro-pitch' footprints can be used (smaller pads, no silkscreen outline, etc.): _0402MP - Micro-pitch footprint for very dense/compact boards _0603MP - Micro-pitch footprint for very dense/compact boards _0805MP - Micro-pitch footprint for very dense/compact boards _1206MP - Micro-pitch footprint for very dense/compact boards; LCSC: C153166
R21 R22 R34 R35 = rcl:R-EU_: RESISTOR, European symbol; LCSC: C84375; SPICEPREFIX: R
SJ2 = microbuilder:SOLDERJUMPER: SMD Solder JUMPER Solder the two pads together to create a connection, or remove the solder to break it. REFLOW - Use this footprint for solder paste and reflow ovens. WAVE - Use this footprint for hand-soldering (larger pads). CLOSED - Has a trace between the two pads to ensure it is closed by default. The trace needs to be cut to disable the jumper, and can be closed again by creating a solder bridge between the two pads.
SW1 SW2 = microbuilder:SWITCH_TACT_SMT: SMT Tact Switches 6x6mm - Digikey: P12940SCT-ND KMR2 (4.6x2.8mm) - Digikey: 401-1426-1-ND EVQ-PQHB55 - Light Touch, 160GF (4.5x4.5mm) - Digikey: P8090SCT-ND KMT0 - KMT021 NGJ LHS (etc.) IP68/Waterproof - Digikey: CKN10289CT-ND; DIGIKEY: CKN10246CT-ND
SW3 = SparkFun-Retired:SWITCH_SPDT: SWCH-10651 Side-actuated SPDT slide switch, as used on the Arduino Pro; LCSC: C128955; PROD_ID: SWCH-10651
TP2 = microbuilder:TESTPOINT: Test Point Various test points for characterisation and PCB testing TESTPOINT_SMT - Compact Surface Mount Test Point [Digikey: 5016KTR-ND]
U1 = microbuilder:NRF52832_MODULE_MDBT42: MDBT42 - BLE Module (nRF52832 QFN) VDD: 1.7-3.6V; DIGIKEY: 1597-1434-ND
U2 U5 = microbuilder:VREG_SOT23-5: SOT23-5 Fixed Voltage Regulators Part Current Out V Out V In V Dropout θJA (°C/W) TJ (°C) Digikey Part No. ADP121 150mA 3.3V 3.4-5.5V 0.09V @ 150mA -- -- ADP121-AUJZ33R7CT-ND ADP121 150mA 3.0V 3.1-5.5V 0.09V @ 150mA -- -- ADP121-AUJZ30R7CT-ND ADP122 300mA 3.3V 3.4-5.5V 0.085V @ 300mA -- -- ADP122AUJZ-3.3-R7CT-ND ADP1712 300mA 3.3V 3.5-5.5V 0.17V @ 300mA -- -- ADP1712AUJZ-3.3-R7TR-ND AP7311 (Low Cost) 150mA 3.3V 3.5-6V 0.15V @ 150mA -- -- AP7311-33WG-7DICT-ND LD39015M18R 150mA 1.8V 1.9V-5.5V 0.08V @ 100mA -- -- 497-6977-1-ND LP2985A-33DBVR 150mA 3.3V 3.3-16V 0.28V @ 150mA 206 150 296-18479-1-ND MCP1824T-3302E/OT 300mA 3.3V 3.5V-6V 0.2V @ 300mA -- -- MCP1824T-3302E/OTCT-ND MIC5205-2.5YM5 TR 150mA 2.5V 2.7-16V 0.165V @ 150mA -- -- 576-1257-2-ND MIC5205-3.0YM5 TR 150mA 3.0V 3.2V-16V 0.165V @ 150mA -- -- 576-1258-2-ND MIC5205-3.3YM5 TR 150mA 3.3V 3.5V-16V 0.165V @ 150mA -- -- 576-1259-2-ND TPS780330220 150mA 3.3V+2.2V 3.6-5.5V 250mV Max -- -- 296-23332-1-ND TDA3663/N1,135 100mA 3.3V 3.5-45V 0.18V @ 50mA -- -- 568-5343-1-ND Max operating temp can be calculated using θJA, TJ (max junction temperature), and power in watts. Set the "Maximum Ambient Temperature" until it reaches TJ ("Max Junction Temperature"), which is the absolute limit for safe use of the regulator: Heat Sink Temperature Calculator <http://www.daycounter.com/Calculators/Heat-Sink-Temperature-Calculator.phtml> For example, With 12V source into a 3.3V LP2985 and a 30mA load, we are dissipating (12V-3.3V) * 0.03A = 0.261W. With a θJA of 206 °C/W, a TJ of 150°C, and 261mW we can safely use the chip without a heat sink up to 75°C (=147.1°C Junction Temperature).; LCSC: C51118
U3 = microbuilder:MCP73831/2: MCP73831/2 LIPO Charger VDD: 3.75 - 6V Temp -40 - 85°C Programmable Charge Rate: 15-500mA NOTE: STAT is a tri-state logic output on the MCP73831 and an open-drain output on the MCP73832. SOT23-5 with 4.2V output and tri-state logic on STAT = MCP73831T-2ACI/OT; LCSC: C14879
U4 = SparkFun-IC-Amplifiers:LMV324: IC LMV324 Quad Op Amp Jellybean quad op-amp Datasheet <http://cdn.sparkfun.com/datasheets/Sensors/Sound/LMV324.pdf> SparkFun Products SparkFun Sensor Kit <https://www.sparkfun.com/products/13754> (DEV-13754) SparkFun Inventor's Kit for Arduino 101 <https://www.sparkfun.com/products/13844> (KIT-13844) SparkFun Sound Detector <https://www.sparkfun.com/products/12642> (SEN-12642); LCSC: C7974; PROD_ID: IC-08227
U6 U8 = microbuilder:AUDIOAMP_PAM8302A: PAM8302A - 2.5W Class-D Mono Audio Amplifier MSOP8 = PAM8302AASCR; LCSC: C113367
U$45 U$51 = jos-ph:APA102: APA102C 5050 RGB LED -- Adafruit DotStar Single LED Pixel Product Page: https://www.adafruit.com/products/2343 Datasheet: https://cdn-shop.adafruit.com/product-files/2343/APA102C.pdf; DIGIKEY: 1568-1826-ND
X2 = microbuilder:CON_JST_PH_2PIN: JST 2-Pin Right-Angle Connector PH-Series - 4UConnector: 17311 SH-Series - 4UConnector: 07278; DIGIKEY: 455-1749-1-ND
X3 = microbuilder:USB: USB Connectors USBMINIB - Surface Mount Female Mini-B USB Connector 4UConnector: 06564; LCSC: C91146
X4 = adafruit2:XTAL: Low cost SMT crystals, no capacitors included http://www.ladyada.net/library/eagle; LCSC: C48615

## Board
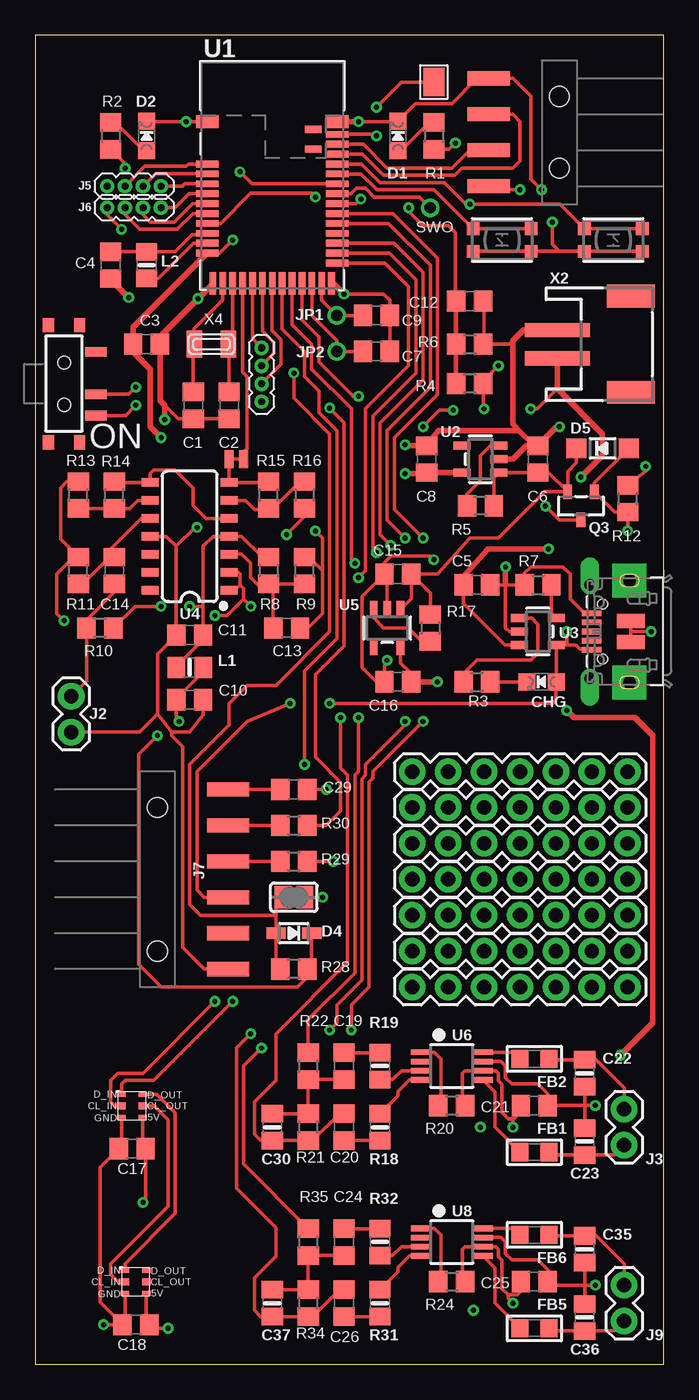
[diagram p1: board, top side]
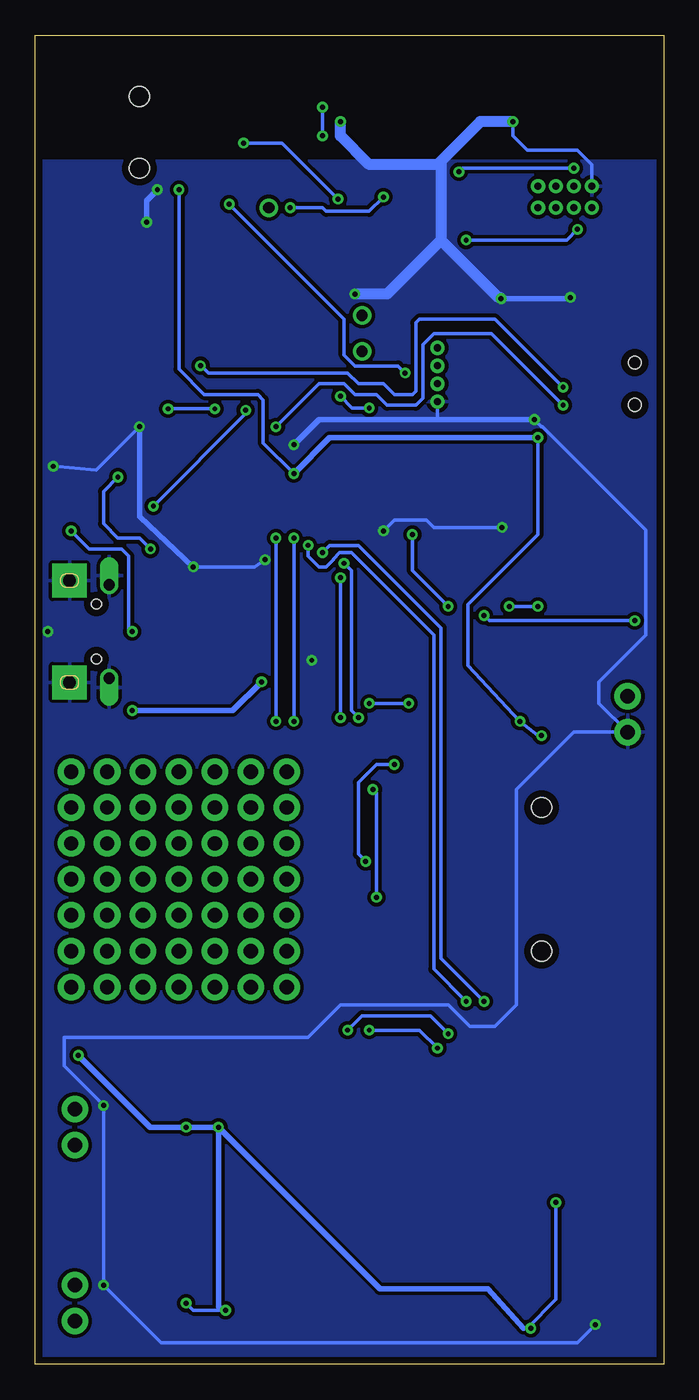
[diagram p2: board, bottom side, seen from below]

Size 44.45 x 93.98 mm. Coordinates in mm from the lower left corner, seen from the top.
Outline: 0,0 44.45,0 44.45,93.98 0,93.98 0,0
Copper layers (1*16): Top 0.035mm / dielectric 1.5mm / Bottom 0.035mm
Design rules "eagleRules *": minimum track width 10mil, minimum drill 0.3mm, track to track 10mil, track to pad 10mil, pad to pad 8mil, via to via 10mil, smd to smd 10mil, copper to edge 20mil, drill to drill 20mil, minimum pad ring 10mil, minimum via ring 8mil, stop-mask expansion 4mil, vias tented up to drill 14mil, thermal gap 10mil

### Footprints (pad centres in the part's own frame; a part is rotated, then mirrored left to right if it is on the bottom)
C0805 = smd 1.3 x 1.5: 1 -0.95,0; 2 0.95,0
0805-NO = smd 1.24 x 1.5: 1 -0.95,0; 2 0.95,0
CHIPLED_0805_NOOUTLINE = smd 1.2 x 1.2: A 0,-1.05; C 0,1.05
SOD-323 = smd 1.35 x 0.8: A 1.27,0; C -1.27,0
SOD-123 = smd 1.4 x 1.4: A 1.85,0; C -1.85,0
_0805 = smd 1.2 x 1.3: 1 -1.016,0; 2 1.016,0
1X04_SMD_RA_MALE = smd 1 x 3: 1 -3.81,5; 2 -1.27,5; 3 1.27,5; 4 3.81,5 | hole 1.4: -2.54,0; 2.54,0
1X02 = drill 1.016 pad 1.88: 1 0,0; 2 2.54,0
1X07 = drill 1.016 pad 1.88: 1 0,0; 2 2.54,0; 3 5.08,0; 4 7.62,0; 5 10.16,0; 6 12.7,0; 7 15.24,0
1X04_1.27MM = drill 0.508 pad 1: 1 0,0; 2 1.27,0; 3 2.54,0; 4 3.81,0
6_PIN_SERIAL_TARGET_SIDE_RA_SMT = smd 1 x 3: 1 -6.35,5; 2 -3.81,5; 3 -1.27,5; 4 1.27,5; 5 3.81,5; 6 6.35,5 | hole 1.4: -5.08,0; 5.08,0
1X01_2MM = drill 0.8 pad 1.27: 1 0,0
SMT-JUMPER_2_NC_TRACE_NO-SILK = smd 0.635 x 1.27: 1 -0.508,0; 2 0.508,0
0805-NO@1 = smd 1.24 x 1.5: 1 -0.95,0; 2 0.95,0
SOT23-R = smd 0.635 x 1.016: 1 -0.95,-1; 2 0.95,-1; 3 0,1
R0805 = smd 1.3 x 1.5: 1 -0.95,0; 2 0.95,0
SOLDERJUMPER_CLOSEDWIRE = smd 1.168 x 1.6: 1 -0.762,0; 2 0.762,0 | smd 0.635 x 0.203: WIRE 0,0
BTN_KMR2_4.6X2.8 = smd 0.9 x 0.9: A 2.05,0.8; A' -2.05,0.8; B 2.05,-0.8; B' -2.05,-0.8
KPS-1290 = smd 0.7 x 1.5: O -2.25,2.25; P 0.75,2.25; S 2.25,2.25 | smd 1 x 0.8: P$1 -4.15,1.1; P$2 -4.15,-1.1; P$3 4.15,-1.1; P$4 4.15,1.1 | hole 0.9: -1.5,0; 1.5,0
PAD-1.5X2.0 = smd 1.5 x 2: P$1 0,0
BLE_MODULE_RAYTAC_MDBT42 = smd 1.6 x 0.9: 1 -4.6,3.8; 39 4.6,3.8 | smd 1.6 x 0.48: 2 -4.6,0.8; 3 -4.6,0.1; 4 -4.6,-0.6; 5 -4.6,-1.3; 6 -4.6,-2; 7 -4.6,-2.7; 8 -4.6,-3.4; 9 -4.6,-4.1; 10 -4.6,-4.8; 11 -4.6,-5.5; 25 4.6,-6.2; 26 4.6,-5.5; 27 4.6,-4.8; 28 4.6,-4.1; 29 4.6,-3.4; 30 4.6,-2.7; 31 4.6,-2; 32 4.6,-1.3; 33 4.6,-0.6; 34 4.6,0.1; 35 4.6,0.8; 36 4.6,1.5; 37 4.6,2.2; 38 4.6,2.9 | smd 0.48 x 1.6: 12 -4.2,-7.65; 13 -3.5,-7.65; 14 -2.8,-7.65; 15 -2.1,-7.65; 16 -1.4,-7.65; 17 -0.7,-7.65; 18 0,-7.65; 19 0.7,-7.65; 20 1.4,-7.65; 21 2.1,-7.65; 22 2.8,-7.65; 23 3.5,-7.65; 24 4.2,-7.65 | smd 1.2 x 0.5: 40 2.9,3.25; 41 2.9,1.85
SOT23-5 = smd 0.55 x 1.2: 1 -0.95,-1.3; 2 0,-1.3; 3 0.95,-1.3; 4 0.95,1.3; 5 -0.95,1.3
SO14 = smd 0.6 x 1.2: 1 -3.175,-2.8; 2 -1.905,-2.8; 3 -0.635,-2.8; 4 0.635,-2.8; 5 1.905,-2.8; 6 3.175,-2.8; 7 4.445,-2.8; 8 4.445,2.8; 9 3.175,2.8; 10 1.905,2.8; 11 0.635,2.8; 12 -0.635,2.8; 13 -1.905,2.8; 14 -3.175,2.8
MSOP8_0.65MM = smd 0.4 x 1.4: 1 -0.975,-2.2; 2 -0.325,-2.2; 3 0.325,-2.2; 4 0.975,-2.2; 5 0.975,2.2; 6 0.325,2.2; 7 -0.325,2.2; 8 -0.975,2.2
APA102_2020 = smd 0.6 x 0.5: C_IN 0.25,1; CL_OUT 1.75,1 | smd 0.6 x 0.35: D_IN 0.25,1.825; D_OUT 1.75,1.825; GND 0.25,0.175; V_CC 1.75,0.175
JSTPH2 = smd 1 x 4.6: 1 -1,-3.7; 2 1,-3.7 | smd 1.6 x 3.4: NC1 -3.4,1.5; NC2 3.4,1.5
4UCONN_20329_V2 = smd 1 x 2: BASE@1 -0.75,-2; BASE@2 0.75,-2 | smd 0.4 x 1.35: D+ 0,0.775; D- -0.65,0.775; GND 1.3,0.775; ID 0.65,0.775; VBUS -1.3,0.775 | drill 0.8 pad 1.143 offset: SPRT@1 -3.3,0.9; SPRT@2 3.3,0.9 | drill 0.9 pad 2.413 square: SPRT@3 -3.6,-1.9; SPRT@4 3.6,-1.9 | hole 0.7: -1.95,0; 1.95,0
XTAL3215 = smd 1.1 x 1.9: P$1 1.2,0; P$2 -1.2,0

### Placement (x,y rotation side)
C1  11.18,67.82 270 top
C2  13.72,67.82 270 top
C3  7.87,72.14 0 top
C4  5.33,77.72 270 top
C5  31.24,55.12 0 top
C6  35.56,64.01 90 top
C7  24.13,71.63 0 top
C8  27.69,64.01 90 top
C9  24.13,74.17 0 top
C10  10.92,46.99 0 top
C11  10.92,51.56 180 top
C12  30.73,75.18 0 top
C13  17.78,52.07 0 top
C14  5.59,56.13 90 top
C15  25.65,55.88 180 top
C16  25.65,48.26 180 top
C17  6.86,15.24 180 top
C18  7.11,2.79 180 top
C19  21.84,21.08 90 top
C20  21.84,16.76 270 top
C21  35.31,18.29 0 top
C22  38.86,20.57 270 top
C23  38.86,15.75 90 top
C24  21.84,8.64 90 top
C25  35.31,5.84 0 top
C26  21.84,4.32 270 top
C29  18.29,40.64 0 top
C30  16.76,16.76 270 top
C35  38.86,8.13 270 top
C36  38.86,3.3 90 top
C37  16.76,4.32 270 top
CHG  35.81,48.26 90 top
D1  25.65,86.87 0 top
D2  7.87,86.87 0 top
D4  18.29,30.48 180 top
D5  40.13,64.77 0 top
FB1  35.31,14.99 0 top
FB2  35.31,21.59 0 top
FB5  35.31,2.54 0 top
FB6  35.31,9.14 0 top
J1  37.08,87.12 90 top
J2  2.54,47.24 270 top
J3  41.66,15.49 90 top
J4  26.67,41.91 0 top
J5  5.08,83.31 0 top
J6  5.08,81.79 0 top
J7  8.64,34.29 270 top
J8  16,71.88 270 top
J9  41.66,3.05 90 top
J10  26.67,39.37 0 top
J11  26.67,36.83 0 top
J12  26.67,34.29 0 top
J13  26.67,31.75 0 top
J14  26.67,29.21 0 top
J15  26.67,26.67 0 top
JP1  21.34,74.17 180 top
JP2  21.34,71.63 0 top
JP3  14.22,64.01 0 top
JP4  27.94,81.79 90 top
L1  10.92,49.28 180 top
L2  7.87,77.72 270 top
Q3  38.61,60.71 180 top
R1  28.19,86.87 270 top
R2  5.33,86.87 270 top
R3  31.24,48.26 0 top
R4  30.73,69.34 180 top
R5  31.5,60.71 180 top
R6  30.73,72.14 0 top
R7  35.56,55.12 0 top
R8  16.51,56.13 270 top
R9  19.05,56.13 90 top
R10  4.57,52.07 180 top
R11  3.05,56.13 90 top
R12  41.91,61.21 90 top
R13  3.05,61.47 90 top
R14  5.59,61.47 90 top
R15  16.51,61.47 90 top
R16  19.05,61.47 270 top
R17  27.94,52.07 270 top
R18  24.38,16.76 90 top
R19  24.38,21.08 270 top
R20  29.46,18.29 0 top
R21  19.3,16.76 270 top
R22  19.3,21.08 270 top
R24  29.46,5.84 0 top
R28  18.29,27.94 180 top
R29  18.29,35.56 0 top
R30  18.29,38.1 0 top
R31  24.38,4.32 90 top
R32  24.38,8.64 270 top
R34  19.3,4.32 270 top
R35  19.3,8.64 270 top
SJ2  18.29,33.02 0 top
SW1  40.89,79.5 0 top
SW2  33.02,79.5 180 top
SW3  2.03,69.34 270 top
TP2  28.19,90.68 0 top
U1  16.76,84.07 0 top
U2  31.5,64.01 90 top
U3  35.56,51.82 270 top
U4  10.92,57.91 90 top
U5  24.89,52.07 180 top
U6  29.46,21.08 270 top
U8  29.46,8.64 270 top
U$45  5.84,17.27 0 top
U$51  6.1,4.83 0 top
X2  40.64,72.14 270 top
X3  40.13,51.82 90 top
X4  12.45,72.14 180 top

### Tracks (layer width: path | path; a pad name or v marks a point on that pad's centre or on a via)
3.3V  (via drill 0.35)
  Top 0.254: v13.97,79.5 13.35,78.88 13.04,78.57 U1.11 | v6.1,80.26 5.08,81.28 J6.1 | v34.29,83.06 32.34,83.06 J1.1 | L1.1 11.87,48.96 9.97,47.06 C10.1 9.97,45.91 v10.16,45.47 | R28.1 19.4,28.1 | 19.4,28.1 19.56,28.26 D4.C | v8.64,44.45 7.3,43.12 7.3,28.26 8.89,26.67 18.54,26.67 19.4,27.53 19.4,28.1
  Top 0.381: U1.11 6.92,73.33 C3.1 6.92,71.56 8.13,70.36 8.13,66.29 v8.89,65.53 | U2.5 C8.1 27.37,62.99 v26.16,62.99
  Bottom 0.254: v13.97,79.5 6.86,79.5 v6.1,80.26 | v26.16,62.99 28.32,65.15 28.32,68.2 28.7,68.58 32.51,68.58 34.29,70.36 v34.29,83.06 | v8.89,65.53 8.89,58.67 13.84,53.72 13.84,49.4 v10.16,45.47 8.89,44.45 v8.64,44.45
  Bottom 0.381: v8.89,65.53 23.62,65.53 v26.16,62.99
A0/0.02
  Top 0.254: U1.15 14.66,70.17 14.99,69.85 14.99,64.77 14.73,64.52 JP3.2
A1/0.03
  Top 0.254: U1.16 15.36,72.52 J8.1
A2/0.04
  Top 0.254: U1.17 16.06,73.08 16.89,72.25 16.89,71.5 J8.2
A3/0.05
  Top 0.254: U1.18 16.76,73.1 17.4,72.46 17.4,70.74 J8.3
A4/0.28
  Top 0.254: U1.5 10.89,82.77 9.91,81.79 J6.4
A5/0.29
  Top 0.254: U1.6 11.13,82.07 9.83,80.77 8.13,80.77 7.62,81.28 J6.3
A6/0.30
  Top 0.254: U1.7 11.15,81.37 10.04,80.26 7.37,80.26 6.35,81.28 J6.2
A7/0.31  (via drill 0.35)
  Top 0.254: U1.8 13.11,80.67 15.24,82.8 19.56,82.8 v19.81,82.55 | v26.42,81.79 26.42,81.53 27.43,80.52 29.21,80.52 29.72,80.01 29.72,69.41 R4.2 R6.1 C12.1
  Bottom 0.254: v19.81,82.55 20.83,81.53 23.88,81.53 24.13,81.79 v26.42,81.79
AMP_REF  (via drill 0.35)
  Top 0.254: R13.2 2.22,62.42 1.78,61.98 1.78,58.35 2.89,57.24 | 2.89,57.24 R11.2 | U4.2 14.35,56.01 14.48,55.88 14.48,55.12 | U4.1 14.1,54.74 14.48,55.12 | 14.48,55.12 14.73,54.86 14.73,54.1 | 14.73,54.1 13.57,52.94 v12.7,52.94 | v2.03,52.58 1.52,53.09 1.52,55.88 2.89,57.24 | 14.73,54.1 v15.24,53.59 | v17.78,58.67 19.05,59.94 R16.2
  Bottom 0.254: v12.7,52.94 12.33,52.58 v2.03,52.58 | v15.24,53.59 17.78,56.13 v17.78,58.67
CO1
  Top 0.254: U$45.CL_OUT 8.4,18.27 9.4,17.27 9.4,11.18 5.33,7.11 5.33,6.35 5.86,5.83 U$51.C_IN
DFU
  Top 0.254: SW2.B' SW2.B 28.21,83.06 24.17,83.06 23.06,84.17 U1.34
DTR
  Top 0.254: J7.1 C29.1
EN
  Top 0.254: U2.3 32.19,64.96 31.5,64.26 31.5,62.48 30.55,61.53 R5.2
EN_VCC2
  Top 0.254: U5.3 23.94,52.77 24.64,52.07 26.42,52.07 27.37,51.12 R17.2
FRST  (via drill 0.35)
  Top 0.254: U1.38 24.02,86.97 v24.13,86.87 | v24.13,88.9 25.91,90.68 TP2.P$1
  Bottom 0.254: v24.13,86.87 v24.13,88.9
GND  (via drill 0.35)
  Top 0.254: 8.82,72.68 C3.2 | C2.2 C1.2 10.09,66.87 9.14,67.82 | U1.1 v10.67,87.87 7.92,87.87 D2.C | v22.85,87.87 v22.86,87.88 25.62,87.88 D1.C 26.89,89.15 29.46,89.15 31.24,90.93 J1.4 33.78,90.93 35.05,89.66 35.05,83.82 v35.81,83.06 | U1.24 21.11,76.42 | SW1.B SW1.B' 37.08,78.7 | SW2.A SW2.A' 37.08,78.7 | 34.73,64.96 35.31,64.96 C6.2 | R12.2 43.18,63.18 v43.18,63.5 | v37.08,66.29 36.9,66.29 | X3.GND 38.83,53.12 37.85,54.1 37.85,55.88 37.34,56.39 35.05,56.39 34.61,55.95 R7.1 33.27,55.12 | C5.2 33.27,55.12 | U3.2 33.53,51.82 33.27,52.07 33.27,55.12 | v36.58,80.77 36.58,79.21 37.08,78.7 | R6.2 31.75,72.14 | 31.75,72.14 33.53,72.14 33.78,72.39 | C12.2 31.75,75.12 31.75,72.14 | v28.19,56.9 27.94,57.15 25.15,57.15 24.7,56.71 C15.2 | C15.2 24.89,55.69 U5.2 | C15.2 23.11,54.29 23.11,49.28 24.13,48.26 C16.2 24.7,49.34 v24.89,49.78 | R9.2 19.37,57.08 20.32,56.13 | C13.2 19.3,52.07 20.32,53.09 20.32,56.13 | 9.97,57.85 C11.2 8.64,50.23 8.64,45.97 | U4.11 9.27,58.55 9.97,57.85 | J2.2 7.37,44.7 8.64,45.97 | 8.64,45.97 9.65,44.7 | 9.65,44.7 10.92,44.7 11.87,45.91 C10.2 | 9.97,57.85 11.31,59.18 v11.43,59.18 | v19.81,58.93 20.32,58.42 20.32,56.13 | v21.84,75.69 24.64,75.69 25.08,75.25 C9.2 C7.2 | U6.7 32.95,21.41 33.27,21.08 33.27,20.25 33.72,19.81 35.56,19.81 36.26,19.12 C21.2 38.86,18.29 | C23.2 38.86,18.29 | 38.86,18.29 C22.2 38.48,19.24 | U8.7 32.95,8.96 33.27,8.64 33.27,7.81 33.72,7.37 35.56,7.37 36.26,6.67 C25.2 36.51,5.59 38.86,5.59 | C36.2 38.86,5.59 | 38.86,5.59 C35.2 38.48,6.79 | J7.6 11.94,27.94 10.41,29.46 10.41,43.69 9.65,44.45 9.65,44.7 | 38.86,18.29 v39.62,18.29 | v39.62,5.59 38.86,5.59 | U$45.GND 6.09,15.42 C17.2 4.57,13.9 4.57,4.38 C18.2
  Top 0.254: U$51.GND 6.35,2.98 C18.2 | C18.2 v4.83,2.79 | X3.BASE@1 42.13,51.82 | 42.13,51.82 42.13,52.32 X3.BASE@2 | 42.13,51.82 v43.56,51.82
  Top 0.381: U1.12 v11.5,75.36 8.82,72.68 | U1.39 v22.85,87.87 | 21.11,76.42 v21.84,75.69 | 34.22,66.04 35.31,64.96 | 34.22,66.04 28.51,66.04 C8.2 26.23,64.96 v26.16,65.02 | U2.2 33.78,64.01 34.73,64.96 C6.2 36.9,66.29 | v33.27,56.39 33.27,55.12 | v9.14,66.8 9.14,67.82 8.82,68.14 C3.2 | v6.6,75.44 5.33,76.71 C4.2 | X2.1 34.53,73.14 33.78,72.39 33.78,66.48 34.22,66.04
  Bottom 0.254: J5.1 5.08,84.84 6.1,85.85 9.65,85.85 10.67,86.87 v10.67,87.87 | v43.18,63.5 40.13,63.25 v37.08,66.29 | v33.27,56.39 28.96,56.39 v28.19,56.9 | v9.14,66.8 8.63,66.29 8.58,66.29 1.27,58.99 1.27,51.56 4.57,48.26 4.57,46.74 J2.2 6.35,44.7 10.41,40.64 10.41,25.4 11.94,23.88 13.72,23.88 15.24,25.4 22.86,25.4 25.15,23.11 42.42,23.11 42.42,21.08 v39.62,18.29 v39.62,5.59 35.56,1.52 6.1,1.52 v4.83,2.79 | v11.43,59.18 16.26,59.18 16.76,59.69 19.05,59.69 v19.81,58.93 | J8.4 16,66.8
  Bottom 0.381: v37.08,66.29 37.08,59.94 v33.27,56.39 | v26.16,65.02 24.38,66.8 16,66.8 v9.14,66.8 | v36.58,80.77 36.58,82.3 v35.81,83.06 | v11.5,75.36 6.68,75.36 v6.6,75.44
  Bottom 0.762: v10.67,87.87 12.96,87.87 15.75,85.09 | 15.75,85.09 15.75,79.5 | 15.75,79.5 11.68,75.44 11.58,75.44 v11.5,75.36 | 15.75,79.5 19.56,75.69 v21.84,75.69 | 15.75,85.09 16,84.84 20.83,84.84 22.86,86.87 v22.86,87.88
  pour Bottom: 0.51,85.09 43.94,85.09 43.94,0.51 0.51,0.51
LED1  (via drill 0.35)
  Top 0.254: U1.31 22.7,82.07 v23.03,82.41 | R1.2 29.28,85.92 v29.72,86.36
  Bottom 0.254: v23.03,82.41 26.98,86.36 v29.72,86.36
LED2  (via drill 0.35)
  Top 0.254: U1.33 15.33,83.47 v14.48,84.33 | R2.2 6.35,84.9 v6.35,84.58
  Bottom 0.254: v6.35,84.58 14.22,84.58 v14.48,84.33
MOSI  (via drill 0.35)
  Top 0.254: U1.27 25.37,79.27 27.43,77.22 27.43,69.6 24.38,66.55 24.38,58.67 v25.15,57.91 | v13.97,25.65 8.38,20.07 6.35,20.07 6.09,19.81 U$45.D_IN
  Bottom 0.254: v25.15,57.91 25.15,57.15 24.38,56.39 23.88,56.39 23.36,56.9 23.36,56.96 22.92,57.4 22.09,57.4 16.26,51.56 16.26,27.94 v13.97,25.65
N$1
  Top 0.254: U1.13 13.26,75.24 11.25,73.22 X4.P$1 11.18,72.07 C1.1
N$2
  Top 0.254: U1.14 13.96,72.45 X4.P$2 13.72,72.07 C2.1
N$3
  Top 0.254: L2.2 8.7,76.77 11.2,79.27 U1.10
N$4
  Top 0.254: CHG.C R3.2
N$5
  Top 0.254: R1.1 27.75,87.38 27.43,87.38 25.87,85.82 D1.A
N$6
  Top 0.254: U4.3 14.61,57.28 15.24,56.64 15.24,55.63 15.75,55.12 16.44,55.12 R8.2 | R9.1 R8.2 | R8.2 16.83,54.86 C13.1
N$7
  Top 0.254: R2.1 5.78,87.38 6.1,87.38 7.65,85.82 D2.A
N$8
  Top 0.254: C4.1 L2.1 | 7.9,78.7 L2.1 | U1.9 12.09,79.89 11.11,79.89 9.88,78.67 L2.1
N$9
  Top 0.254: R3.1 30.29,48.83 31.24,49.78 35.05,49.78 35.56,50.29 35.56,52.32 35.12,52.77 U3.1
N$10
  Top 0.254: U3.5 36.51,53.12 R7.2
N$11
  Top 0.254: C14.1 5.59,54.61 3.62,52.64 R10.2 3.62,48.33 J2.1
N$12
  Top 0.254: C14.2 5.33,57.08 | 5.33,57.08 5.27,57.08 3.37,55.18 R11.1 | U4.10 7.49,59.82 5.33,57.66 5.33,57.08
N$13  (via drill 0.35)
  Top 0.254: SJ2.2 v20.32,33.02 | v20.57,40.64 C29.2
  Bottom 0.254: v20.32,33.02 20.32,40.39 v20.57,40.64
N$14
  Top 0.254: U$45.D_OUT 8.59,19.1 9.91,17.78 9.91,10.67 6.35,7.11 U$51.D_IN
N$15
  Top 0.254: U4.9 7.24,61.09 6.67,60.52 R14.1 R13.1
N$16
  Top 0.254: R14.2 5.65,62.36 U4.8 8.12,62.99 8.38,63.25 9.91,63.25 11.18,61.98 11.18,60.71 12.06,59.82 U4.5
N$17
  Top 0.254: U4.6 14.86,61.09 15.49,60.45 16.44,60.45 R15.1 16.95,60.96 17.27,60.96 18.73,62.42 R16.1
N$18
  Top 0.254: R15.2 16.45,62.36 U4.7 JP3.1
N$19
  Top 0.254: U6.4 26.46,20.11 25.65,19.3 25.65,18.98 R18.2
N$20
  Top 0.254: U6.3 25.91,20.76 25.28,20.13 R19.2
N$21
  Top 0.254: C20.2 R18.1
N$22
  Top 0.254: U6.8 33.82,22.06 FB2.1
N$23
  Top 0.254: U6.5 32.5,19.27 32.5,16.77 FB1.1
N$24
  Top 0.254: C19.2 R19.1
N$25
  Top 0.254: C30.1 R21.1 R22.2 C19.1
N$26  (via drill 0.35, 0.35 pad 0.25)
  Top 0.254: SW3.S 6.39,67.09 v7.11,67.82 | Q3.3 37.07,59.71 v36.1,60.68 | v29.56,67.47 28.6,67.47 v27.43,66.29
  Bottom 0.254: v7.11,67.82 12.19,72.9 16.24,72.9 17.02,72.12 17.02,68.33 17.53,67.82 19.56,67.82 20.32,68.58 21.84,68.58 22.61,69.34 24.38,69.34 v27.43,66.29 | v36.1,60.68 29.56,67.21 v29.56,67.47
N$33
  Top 0.254: J7.3 R29.1
N$34
  Top 0.254: R30.1 J7.2
N$35
  Top 0.254: U8.4 26.46,7.66 25.65,6.86 25.65,6.54 R31.2
N$36
  Top 0.254: U8.3 25.91,8.31 25.28,7.69 R32.2
N$37
  Top 0.254: C26.2 R31.1
N$38
  Top 0.254: U8.8 33.82,9.61 FB6.1
N$39
  Top 0.254: U8.5 32.5,6.82 32.5,4.33 FB5.1
N$40
  Top 0.254: R32.1 C24.2
N$41
  Top 0.254: C37.1 R34.1 R35.2 C24.1
P0.07  (via drill 0.35)
  Top 0.254: U1.20 18.16,73.53 19.56,72.14 19.56,70.36 22.35,67.56 22.35,56.9 v22.61,56.64 | v21.59,45.72 21.59,42.16 22.1,41.66 22.1,28.45 17.02,23.37 17.02,20.07 15.49,18.54 15.49,16.26 15.94,15.81 C30.2 R21.2 19.62,15.81 21.52,17.71 C20.1
  Bottom 0.254: v22.61,56.64 22.1,56.13 22.1,46.23 v21.59,45.72
P0.09/NFC1
  Top 0.254: C7.1 JP2.1 21.34,72.39 19.56,74.16 U1.22
P0.10/NFC2
  Top 0.254: C9.1 JP1.1 20.26,75.24 U1.23
P0.11  (via drill 0.35)
  Top 0.254: U1.25 24.74,77.87 26.42,76.2 26.42,70.61 23.37,67.56 23.37,56.13 v22.86,55.63 | v22.86,45.72 22.86,41.91 22.61,41.66 22.61,27.69 19.3,24.38 R22.1
  Bottom 0.254: v22.86,55.63 v22.86,45.72
P0.15  (via drill 0.35)
  Top 0.254: U1.29 24.99,80.67 27.94,77.72 27.94,69.09 24.89,66.04 24.89,59.69 v26.16,58.42 | v26.16,45.47 26.16,45.21 23.37,42.42 23.37,41.66 23.11,41.4 23.11,27.18 21.34,25.4 21.34,24.13 v20.83,23.62 | v16,22.35 14.73,21.08 14.73,14.16 R35.1
  Bottom 0.254: v26.16,58.42 v26.16,45.47 | v20.83,23.62 17.27,23.62 v16,22.35
P0.16  (via drill 0.35)
  Top 0.254: U1.30 25.31,81.37 28.45,78.23 28.45,68.58 25.4,65.53 25.4,60.45 v27.43,58.42 | v27.43,45.47 23.88,41.91 23.88,41.45 23.62,41.19 23.62,26.67 22.35,25.4 v22.35,23.62 | v15.24,23.37 14.22,22.35 14.22,12.45 17.02,9.65 17.02,7.62 15.49,6.1 15.49,3.81 15.94,3.37 C37.2 R34.2 19.62,3.37 21.52,5.27 C26.1
  Bottom 0.254: v27.43,58.42 v27.43,45.47 | v22.35,23.62 21.34,24.64 16.51,24.64 v15.24,23.37
P0.27
  Top 0.254: U1.4 10.58,83.47 10.41,83.31 J5.4
RESET  (via drill 0.35, 0.35 pad 0.25)
  Top 0.254: U1.35 23.08,84.87 24.38,83.57 28.96,83.57 30.48,82.04 v30.73,82.04 37.1,82.04 SW1.A' SW1.A | SJ2.1 17.02,32.51 17.02,31.75 | 17.02,31.75 D4.A 17.02,28.26 R28.2 | 17.02,31.75 11.68,31.75 10.92,32.51 10.92,42.42 13.72,45.21 13.72,46.74 14.99,48.01 17.02,48.01 20.83,51.82 20.83,65.79 18.29,68.33 v18.29,70.1
  Bottom 0.254: v30.73,82.04 22.61,73.91 22.61,71.37 21.82,70.59 18.78,70.59 v18.29,70.1
RXD  (via drill 0.35)
  Top 0.254: U1.21 18.86,73.85 20.07,72.64 20.07,70.87 22.48,68.46 v22.86,68.46 | v20.83,67.62 21.84,66.61 21.84,50.8 19.81,48.77 19.81,42.93 21.59,41.15 21.59,39.12 20.57,38.1 R30.2
  Bottom 0.254: v22.86,68.46 22.03,67.62 v20.83,67.62
SCK  (via drill 0.35)
  Top 0.254: U1.26 25.06,78.57 26.92,76.71 26.92,70.1 23.88,67.06 23.88,57.66 v24.13,57.4 | v12.7,25.65 7.62,20.57 5.84,20.57 5.33,20.07 5.33,18.54 5.6,18.27 U$45.C_IN
  Bottom 0.254: v24.13,57.4 23.62,57.91 21.59,57.91 15.75,52.07 15.75,28.7 v12.7,25.65
SCL
  Top 0.254: J5.3 8.51,84.2 12.14,84.2 U1.3
SD1
  Top 0.254: U6.1 28.23,22.06 28.7,21.59 28.7,18.22 28.58,18.22 R20.1
SD2
  Top 0.152: R24.1 28.51,5.78 28.7,5.78
  Top 0.254: U8.1 28.23,9.61 28.7,9.14 28.7,5.78
SDA
  Top 0.254: J5.2 7.75,84.71 10.67,84.71 10.83,84.87 U1.2
SWCLK
  Top 0.254: U1.36 23.14,85.57 24.64,84.07 29.67,84.07 30.18,84.58 33.78,84.58 34.29,85.09 34.29,87.88 33.78,88.39 J1.3
SWDIO
  Top 0.254: U1.37 23.2,86.27 24.89,84.58 29.46,84.58 30.73,85.85 J1.2
SWO
  Top 0.254: JP4.1 27.18,82.55 23.96,82.55 23.34,83.17 22.72,83.17 22.32,82.77 U1.32
TXD  (via drill 0.35)
  Top 0.254: U1.19 17.46,73.21 19.05,71.63 19.05,69.85 20.07,68.83 20.07,67.31 21.34,66.04 21.34,51.31 19.05,49.02 v19.05,42.42 | R29.2 v21.08,35.56
  Bottom 0.254: v19.05,42.42 20.32,42.42 21.59,41.15 21.59,36.07 v21.08,35.56
VBAT  (via drill 0.35, 0.35 pad 0.25, 0.35 pad 0.51)
  Top 0.254: U3.3 33.21,50.87 30.29,53.78 C5.1 | v31.75,67.56 31.68,67.63 R4.1 31.68,69.53 v32.77,70.61 | v35.05,67.56 35.53,67.56 36.94,68.98 | SW3.P 6.62,68.59 v7.11,69.09
  Top 0.381: X2.2 36.94,68.98 40.13,65.79 40.13,64.26 v38.61,62.74 | C5.1 30.29,55.69 32,57.66 v36.31,57.66
  Bottom 0.254: v31.75,67.56 v35.05,67.56 | v7.11,69.09 11.94,73.91 17.27,73.91 17.53,73.66 17.53,68.83 17.78,68.58 19.05,68.58 19.81,69.34 21.59,69.34 22.35,70.1 32.21,70.1 32.69,70.59 v32.77,70.61 | v38.61,62.74 39.62,61.72 39.62,59.44 38.61,58.42 37.07,58.42 v36.31,57.66
VBUS  (via drill 0.35)
  Top 0.254: D5.A 39.56,62.35 Q3.1 41,60.26 R12.1 v41.91,58.93 | X3.VBUS 39.29,50.59 38.52,50.59 38.24,50.87 37.59,50.87 | 37.59,50.87 U3.4 CHG.A 36.83,48.23 36.83,46.99 36.58,46.74 v20.83,46.74 | v37.59,51.82 37.59,50.87 | v18.03,46.74 14.99,45.47 11.43,41.91 11.43,33.53 11.94,33.02 J7.4
  Bottom 0.254: v41.91,58.93 40.64,57.66 38.35,57.66 37.85,57.15 37.85,51.82 v37.59,51.82 | v20.83,46.74 v18.03,46.74
VCC_2  (via drill 0.35, 0.35 pad 0.25)
  Top 0.152: R24.2 30.41,5.78 30.23,5.78 | R20.2 30.23,18.29 30.23,18.22
  Top 0.254: U5.5 25.84,49.6 26.6,48.83 C16.1 | 30.23,18.22 30.23,20.57 30.41,20.76 U6.6 32.58,20.76 32.77,20.57 32.77,20.04 33.01,19.8 33.01,17.79 33.46,17.34 33.85,17.34 | 33.46,4.89 33.01,5.34 33.01,7.36 32.77,7.6 32.77,8.13 32.58,8.31 U8.6 30.41,8.31 30.23,8.13 30.23,5.78 | U$45.V_CC 7.59,15.46 C17.1 7.81,11.62 v7.62,11.43 | U$51.V_CC 7.85,3.01 C18.1 8.32,2.54 v9.4,2.54 | C21.1 34.36,17.85 33.85,17.34 | 33.46,4.89 34.1,4.89 34.36,5.15 C25.1 | 33.85,17.34 33.78,17.27 v33.78,16.76 | 33.46,4.89 33.46,4.64 v33.78,4.32
  Top 0.381: C16.1 v28.45,48.26 | v37.59,46.23 38.1,45.72 42.42,45.72 43.69,44.45 43.69,24.13 v41.4,21.84 | v31.5,16.76 31.5,16.95
  Bottom 0.254: 9.91,2.54 9.65,2.54 | 9.65,2.54 v9.4,2.54 | v7.62,11.43 7.62,4.57 9.65,2.54 | v33.78,4.32 33.27,3.81 v30.99,3.81
  Bottom 0.381: v28.45,48.26 30.48,46.23 v37.59,46.23 | 9.91,2.54 12.45,5.33 20.07,5.33 v31.5,16.76 | v41.4,21.84 36.32,16.76 v33.78,16.76 v31.5,16.76 | v31.5,16.76 31.5,4.06 v30.99,3.81
VCCA  (via drill 0.35)
  Top 0.254: R8.1 16.07,57.08 14.61,58.55 U4.4 12.57,58.55 11.87,57.85 11.87,53.59 | 11.87,53.59 C11.1 11.87,51.24 9.97,49.34 L1.2 | 11.87,53.59 v10.92,53.59 | v8.89,53.59 7.05,53.59 R10.1
  Bottom 0.254: v10.92,53.59 v8.89,53.59
VIN
  Top 0.254: R5.1 32.45,62.71 U2.1 C6.1 36.31,63.06 Q3.2 | Q3.2 37.66,63.13 38.28,63.75 D5.C | C15.1 27.94,54.54 R17.1 | C15.1 28.45,55.88 30.73,58.42 32.77,58.42 36.05,61.71 Q3.2 | U5.1 26.6,54.13 C15.1
VO1+
  Top 0.254: FB1.2 36.51,14.8 C23.1 40.96,14.8 J3.1
VO1-
  Top 0.254: FB2.2 36.39,21.52 C22.1 39.56,21.52 39.62,21.59 41.66,19.56 J3.2
VO2+
  Top 0.254: FB5.2 36.51,2.35 C36.1 40.96,2.35 J9.1
VO2-
  Top 0.254: FB6.2 36.39,9.08 C35.1 39.56,9.08 39.62,9.14 41.66,7.11 J9.2

### Text on the board
tNames: SWO | ON